# Altium schematic sheet Sheet1.SchDoc
size A4; SheetNumber: 1; SheetTotal: 1
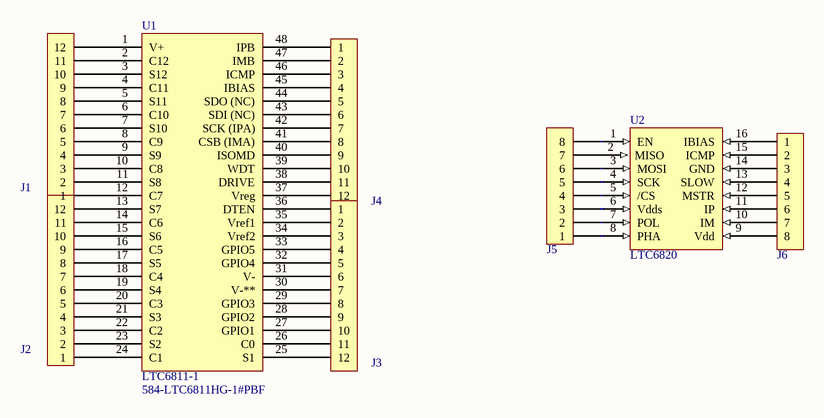
[diagram p0: Sheet1.SchDoc]

## Parts
J1  61301211121  [J_Pinheader_1x12]  (value not drawn)
J2  61301211121  [J_Pinheader_1x12]  (value not drawn)
J3  61301211121  [J_Pinheader_1x12]  (value not drawn)
J4  61301211121  [J_Pinheader_1x12]  (value not drawn)
J5  61301211121  [J_Pinheader_1x8]  (value not drawn)
J6  61301211121  [J_Pinheader_1x8]  (value not drawn)
U1  Supplier Part Number 2: 584-LTC6811HG-1#PBF  [U_LTC6811G-2]  (hidden comment: LTC6811-1)
U2  LTC6820  [LTC6820]

## Nets
NetJ1_1: J1.1 U1.12(C7)
NetJ1_2: J1.2 U1.11(S8)
NetJ1_3: J1.3 U1.10(C8)
NetJ1_4: J1.4 U1.9(S9)
NetJ1_5: J1.5 U1.8(C9)
NetJ1_6: J1.6 U1.7(S10)
NetJ1_7: J1.7 U1.6(C10)
NetJ1_8: J1.8 U1.5(S11)
NetJ1_9: J1.9 U1.4(C11)
NetJ1_10: J1.10 U1.3(S12)
NetJ1_11: J1.11 U1.2(C12)
NetJ1_12: J1.12 U1.1(V+)
NetJ2_1: J2.1 U1.24(C1)
NetJ2_2: J2.2 U1.23(S2)
NetJ2_3: J2.3 U1.22(C2)
NetJ2_4: J2.4 U1.21(S3)
NetJ2_5: J2.5 U1.20(C3)
NetJ2_6: J2.6 U1.19(S4)
NetJ2_7: J2.7 U1.18(C4)
NetJ2_8: J2.8 U1.17(S5)
NetJ2_9: J2.9 U1.16(C5)
NetJ2_10: J2.10 U1.15(S6)
NetJ2_11: J2.11 U1.14(C6)
NetJ2_12: J2.12 U1.13(S7)
NetJ3_1: J3.1 U1.36(DTEN)
NetJ3_2: J3.2 U1.35(Vref1)
NetJ3_3: J3.3 U1.34(Vref2)
NetJ3_4: J3.4 U1.33(GPIO5)
NetJ3_5: J3.5 U1.32(GPIO4)
NetJ3_6: J3.6 U1.31(V-)
NetJ3_7: J3.7 U1.30(V-**)
NetJ3_8: J3.8 U1.29(GPIO3)
NetJ3_9: J3.9 U1.28(GPIO2)
NetJ3_10: J3.10 U1.27(GPIO1)
NetJ3_11: J3.11 U1.26(C0)
NetJ3_12: J3.12 U1.25(S1)
NetJ4_1: J4.1 U1.48(IPB)
NetJ4_2: J4.2 U1.47(IMB)
NetJ4_3: J4.3 U1.46(ICMP)
NetJ4_4: J4.4 U1.45(IBIAS)
NetJ4_5: J4.5 U1.44(SDO_(NC))
NetJ4_6: J4.6 U1.43(SDI_(NC))
NetJ4_7: J4.7 U1.42(SCK_(IPA))
NetJ4_8: J4.8 U1.41(CSB_(IMA))
NetJ4_9: J4.9 U1.40(ISOMD)
NetJ4_10: J4.10 U1.39(WDT)
NetJ4_11: J4.11 U1.38(DRIVE)
NetJ4_12: J4.12 U1.37(Vreg)
NetJ5_1: J5.1 U2.8(PHA)
NetJ5_2: J5.2 U2.7(POL)
NetJ5_3: J5.3 U2.6(Vdds)
NetJ5_4: J5.4 U2.5(/CS)
NetJ5_5: J5.5 U2.4(SCK)
NetJ5_6: J5.6 U2.3(MOSI)
NetJ5_7: J5.7 U2.2(MISO)
NetJ5_8: J5.8 U2.1(EN)
NetJ6_1: J6.1 U2.16(IBIAS)
NetJ6_2: J6.2 U2.15(ICMP)
NetJ6_3: J6.3 U2.14(GND)
NetJ6_4: J6.4 U2.13(SLOW)
NetJ6_5: J6.5 U2.12(MSTR)
NetJ6_6: J6.6 U2.11(IP)
NetJ6_7: J6.7 U2.10(IM)
NetJ6_8: J6.8 U2.9(Vdd)

## Library data of the parts
J1-J4 = J_Pinheader_1x12: THT Vertical Pin Header WR-PHD, Pitch 2.54 mm, Single Row, 12 pins; Manufacturer 1: Wurth Electronics; Number of Positions: 12; Gender: Male; Connector Type: Male Pin; Pitch: 0.1inch; Supplier 1: Digi-Key; Manufacturer Part Number 1: 61301211121; RoHS: Yes; Category: Connectors; Stock 1: 2124; Pricing 1: 1=0,57000, 10=0,48400, 25=0,40400, 50=0,33700, 100=0,30600, 1000=0,27800 (USD); Mount: Through Hole; Contact Plating: Gold; Contact Material: Copper; Color: Black; Number of Rows: 1; Packaging: Bulk; Termination: Solder; Number of Contacts: 12; Contact Mating Length: 0.236inch; REACH SVHC: Unknown; RoHS Compliant: Yes; ComponentLink1URL: http://www.farnell.com/cad/1737268.pdf?src-supplier=Element14; ComponentLink1Description: http://www.farnell.com/cad/1737268.pdf?src-supplier=Element14; ComponentLink2URL: https://katalog.we-online.de/em/datasheet/6130xx11121.pdf?src-supplier=Digi-Key; ComponentLink2Description: https://katalog.we-online.de/em/datasheet/6130xx11121.pdf?src-supplier=Digi-Key
J5 J6 = J_Pinheader_1x8: THT Vertical Pin Header WR-PHD, Pitch 2.54 mm, Single Row, 12 pins; Manufacturer 1: Wurth Electronics; Number of Positions: 12; Gender: Male; Connector Type: Male Pin; Pitch: 0.1inch; Supplier 1: Digi-Key; Manufacturer Part Number 1: 61301211121; RoHS: Yes; Category: Connectors; Stock 1: 2124; Pricing 1: 1=0,57000, 10=0,48400, 25=0,40400, 50=0,33700, 100=0,30600, 1000=0,27800 (USD); Mount: Through Hole; Contact Plating: Gold; Contact Material: Copper; Color: Black; Number of Rows: 1; Packaging: Bulk; Termination: Solder; Number of Contacts: 12; Contact Mating Length: 0.236inch; REACH SVHC: Unknown; RoHS Compliant: Yes; ComponentLink1URL: http://www.farnell.com/cad/1737268.pdf?src-supplier=Element14; ComponentLink1Description: http://www.farnell.com/cad/1737268.pdf?src-supplier=Element14; ComponentLink2URL: https://katalog.we-online.de/em/datasheet/6130xx11121.pdf?src-supplier=Digi-Key; ComponentLink2Description: https://katalog.we-online.de/em/datasheet/6130xx11121.pdf?src-supplier=Digi-Key
U1 = U_LTC6811-1: 12 Channel Multicell Battery Monitor with Daisy Chain Interface, Generation 4; Manufacturer 1: Analog Devices; Manufacturer: Analog Devices / Linear Technology; Manufacturer Part Number: LTC6811HG-1#PBF; .Creator: GP; ComponentLink1URL: https://www.analog.com/media/en/technical-documentation/data-sheets/ltc6811-1-6811-2.pdf; ComponentLink1Description: Datasheet; ComponentLink2Description: Where buy it; ComponentLink2URL: https://www.mouser.es/ProductDetail/Analog-Devices/LTC6811IG-23ZZTRPBF?qs=byeeYqUIh0NWJgxDt7RX5g%3D%3D; Supplier 1: Digi-Key; Category: Battery Management; RoHS Compliant: Yes; ComponentLink3URL: http://www.linear.com/docs/55980?src-supplier=Digi-Key; ComponentLink3Description: http://www.linear.com/docs/55980?src-supplier=Digi-Key; ComponentLink4URL: https://datasheet.octopart.com/LTC6811HG-1%23PBF-Analog-Devices-datasheet-138896417.pdf?src-supplier=Upverter; ComponentLink4Description: https://datasheet.octopart.com/LTC6811HG-1%23PBF-Analog-Devices-datasheet-138896417.pdf?src-supplier=Upverter; ComponentLink5URL: https://datasheet.octopart.com/LTC6811HG-1%23PBF-Linear-Technology-datasheet-66874450.pdf?src-supplier=Linear+Technology; ComponentLink5Description: https://datasheet.octopart.com/LTC6811HG-1%23PBF-Linear-Technology-datasheet-66874450.pdf?src-supplier=Linear+Technology; ComponentLink6URL: https://sigma.octopart.com/57702806/technical_drawing/Linear-Technology-LTC6811HG-1%23PBF.pdf?src-supplier=Linear+Technology; ComponentLink6Description: https://sigma.octopart.com/57702806/technical_drawing/Linear-Technology-LTC6811HG-1%23PBF.pdf?src-supplier=Linear+Technology; Supplier Part Number 1: 505-LTC6811HG-1#PBF-ND; Case/Package: SSOP; Supplier 2: Mouser; RoHS: Yes; Stock 2: 3108; Pricing 2: 1=21,6, 10=19,92, 50=19,02, 100=19,02, 1000=15,13, 10000=15,13 (USD); ComponentLink7URL: https://datasheet.octopart.com/LTC6811HG-1%23PBF-Analog-Devices-datasheet-138896417.pdf?src-supplier=Element14; ComponentLink7Description: https://datasheet.octopart.com/LTC6811HG-1%23PBF-Analog-Devices-datasheet-138896417.pdf?src-supplier=Element14; Manufacturer Part Number 1: LTC6811-1
U2 = U_LTC6820